# EAGLE design dnc (EAGLE 7.1.0)
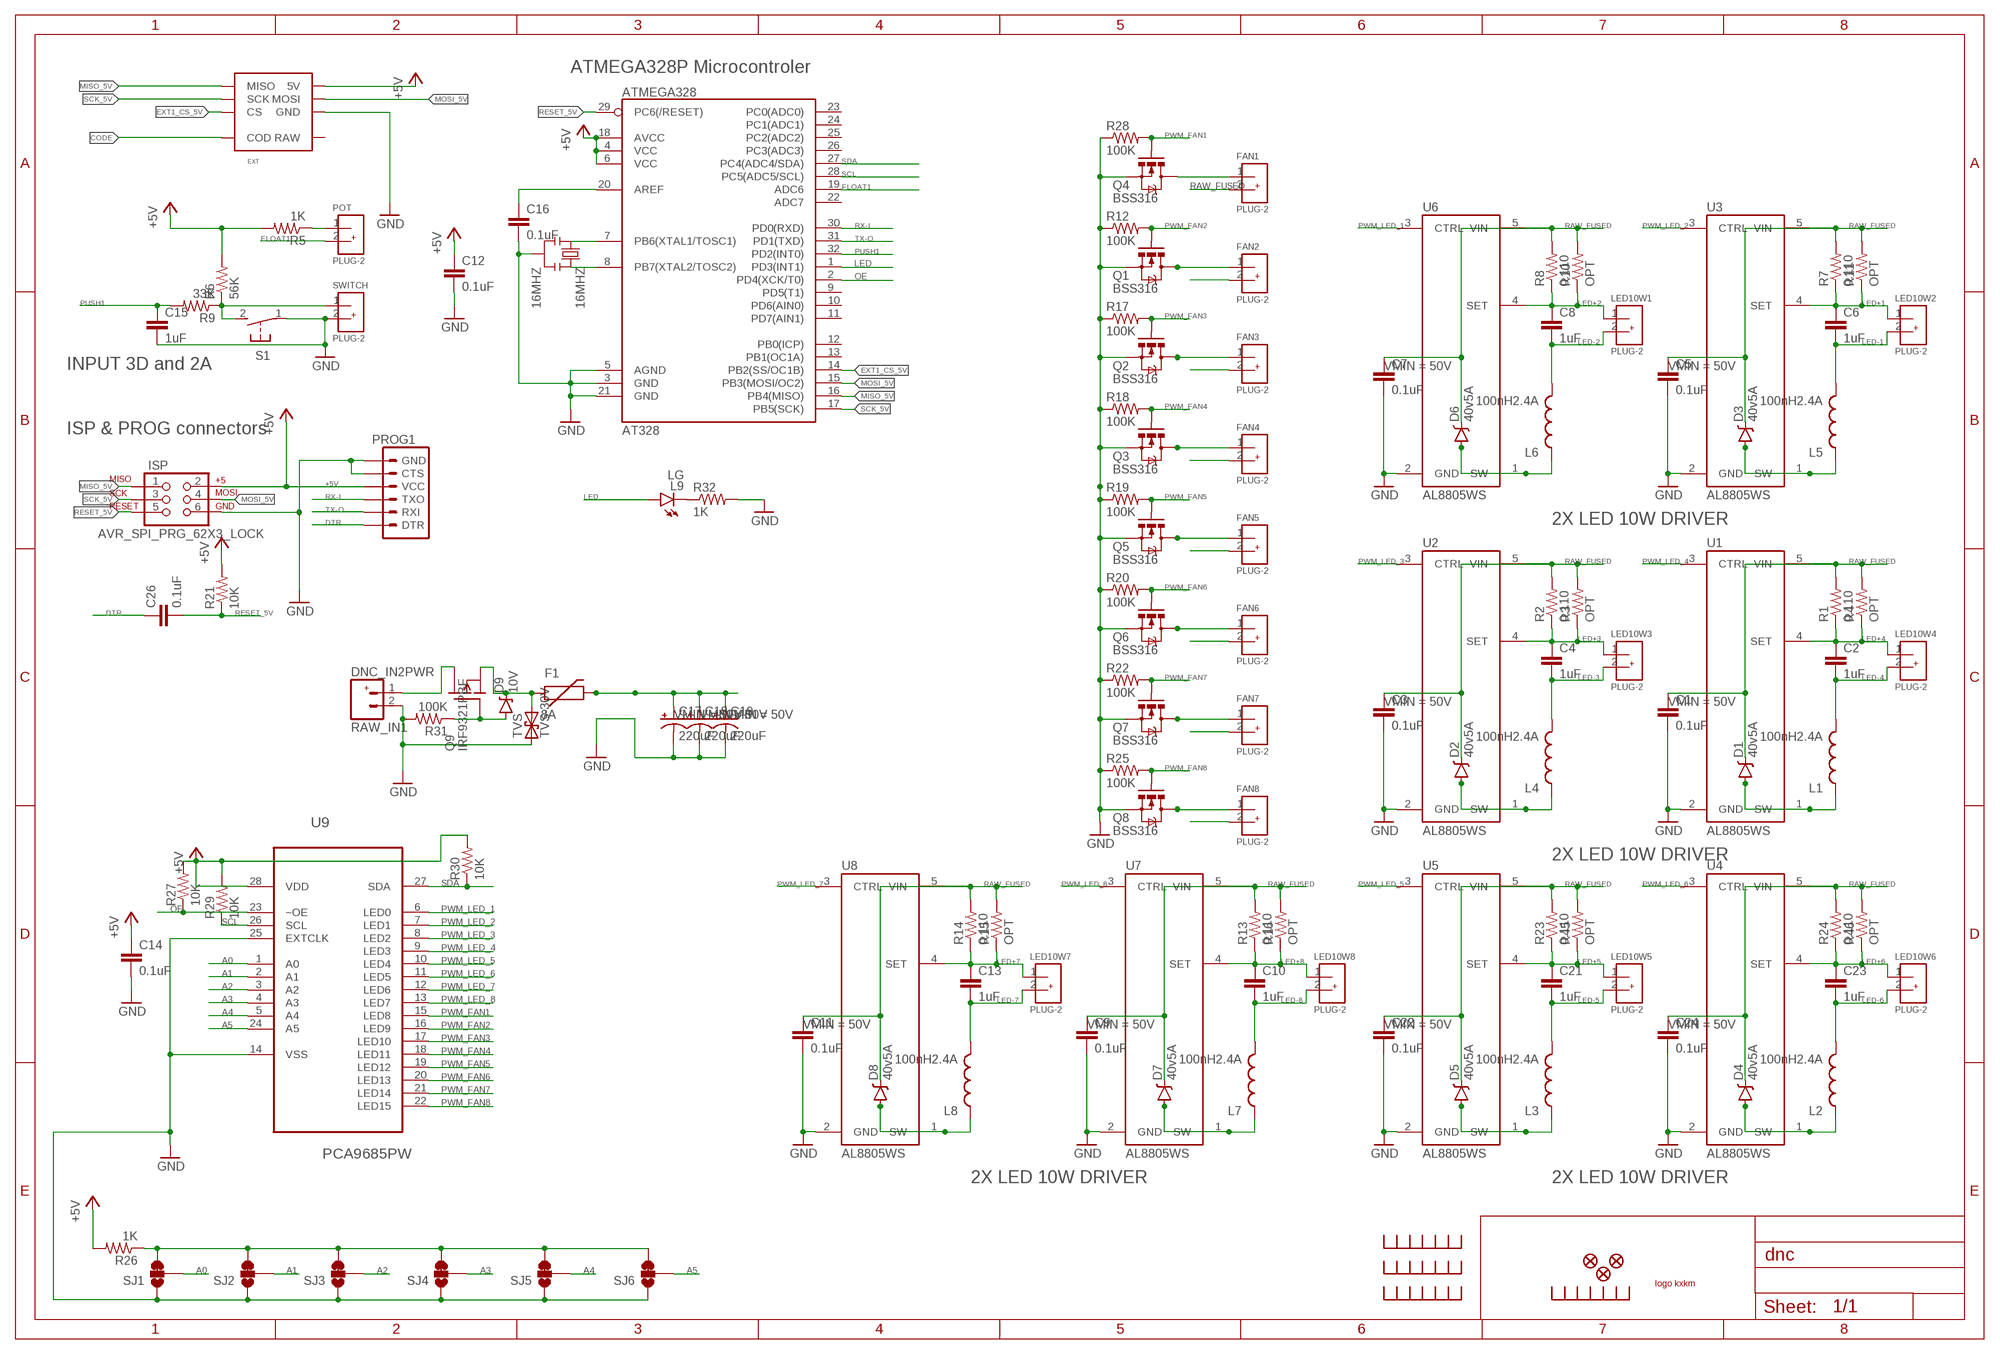
[diagram p0: schematic, sheet 1]

## Parts
16MHZ  16MHZ  RESONATOR16MHZ  [RESONATOR-SMD]
AT328  ATMEGA328  ATMEGA168  [TQFP32-08]
C1  0.1uF  C-EUC0603  [C0603]
C2  1uF  C-EUC0603  [C0603]
C3  0.1uF  C-EUC0603  [C0603]
C4  1uF  C-EUC0603  [C0603]
C5  0.1uF  C-EUC0603  [C0603]
C6  1uF  C-EUC0603  [C0603]
C7  0.1uF  C-EUC0603  [C0603]
C8  1uF  C-EUC0603  [C0603]
C9  0.1uF  C-EUC0603  [C0603]
C10  1uF  C-EUC0603  [C0603]
C11  0.1uF  C-EUC0603  [C0603]
C12  0.1uF  C-EUC0603  [C0603]
C13  1uF  C-EUC0603  [C0603]
C14  0.1uF  C-EUC0603  [C0603]
C15  1uF  C-EUC0603  [C0603]
C16  0.1uF  C-EUC0603  [C0603]
C17  220uF  CAP_POLE  [PANASONIC_E]
C18  220uF  CAP_POLE  [PANASONIC_E]
C19  220uF  CAP_POLE  [PANASONIC_E]
C21  1uF  C-EUC0603  [C0603]
C22  0.1uF  C-EUC0603  [C0603]
C23  1uF  C-EUC0603  [C0603]
C24  0.1uF  C-EUC0603  [C0603]
C26  0.1uF  C-EUC0603  [C0603]
D1  40v5A  DIODE_SCHOTKYSMPA  [DO-221]
D2  40v5A  DIODE_SCHOTKYSMPA  [DO-221]
D3  40v5A  DIODE_SCHOTKYSMPA  [DO-221]
D4  40v5A  DIODE_SCHOTKYSMPA  [DO-221]
D5  40v5A  DIODE_SCHOTKYSMPA  [DO-221]
D6  40v5A  DIODE_SCHOTKYSMPA  [DO-221]
D7  40v5A  DIODE_SCHOTKYSMPA  [DO-221]
D8  40v5A  DIODE_SCHOTKYSMPA  [DO-221]
D9  10V  DIODE-ZENERSOD-123  [SOD-123]
EXT1  EXT  EXT-DNC  [EXTPINDNC]
F1  8A  PTCPTH  [PTC]
FAN1  PLUG-2  M02PLUG  [PLUG_02]
FAN2  PLUG-2  M02PLUG  [PLUG_02]
FAN3  PLUG-2  M02PLUG  [PLUG_02]
FAN4  PLUG-2  M02PLUG  [PLUG_02]
FAN5  PLUG-2  M02PLUG  [PLUG_02]
FAN6  PLUG-2  M02PLUG  [PLUG_02]
FAN7  PLUG-2  M02PLUG  [PLUG_02]
FAN8  PLUG-2  M02PLUG  [PLUG_02]
ISP  AVR_SPI_PRG_62X3_LOCK  [2X3_LOCK]
JP13  FIDUCIAL1X2.5  [FIDUCIAL-1X2.5]
JP14  FIDUCIAL1X2.5  [FIDUCIAL-1X2.5]
JP19  FIDUCIAL1X2.5  [FIDUCIAL-1X2.5]
L1  100nH2.4A  INDUCTORPWR  [CDRH125]
L2  100nH2.4A  INDUCTORPWR  [CDRH125]
L3  100nH2.4A  INDUCTORPWR  [CDRH125]
L4  100nH2.4A  INDUCTORPWR  [CDRH125]
L5  100nH2.4A  INDUCTORPWR  [CDRH125]
L6  100nH2.4A  INDUCTORPWR  [CDRH125]
L7  100nH2.4A  INDUCTORPWR  [CDRH125]
L8  100nH2.4A  INDUCTORPWR  [CDRH125]
L9  LG  LED1206  [LED-1206]
LED10W1  PLUG-2  M02PLUG  [PLUG_02]
LED10W2  PLUG-2  M02PLUG  [PLUG_02]
LED10W3  PLUG-2  M02PLUG  [PLUG_02]
LED10W4  PLUG-2  M02PLUG  [PLUG_02]
LED10W5  PLUG-2  M02PLUG  [PLUG_02]
LED10W6  PLUG-2  M02PLUG  [PLUG_02]
LED10W7  PLUG-2  M02PLUG  [PLUG_02]
LED10W8  PLUG-2  M02PLUG  [PLUG_02]
POT  PLUG-2  M02PLUG  [PLUG_02]
PROG1  ARDUINO_SERIAL_PROGRAMLOCK  [1X06_LOCK]
Q1  BSS316  MOSFET-NCHANNELBSS316  [SOT23-3]
Q2  BSS316  MOSFET-NCHANNELBSS316  [SOT23-3]
Q3  BSS316  MOSFET-NCHANNELBSS316  [SOT23-3]
Q4  BSS316  MOSFET-NCHANNELBSS316  [SOT23-3]
Q5  BSS316  MOSFET-NCHANNELBSS316  [SOT23-3]
Q6  BSS316  MOSFET-NCHANNELBSS316  [SOT23-3]
Q7  BSS316  MOSFET-NCHANNELBSS316  [SOT23-3]
Q8  BSS316  MOSFET-NCHANNELBSS316  [SOT23-3]
Q9  IRF9321PBF  [SO-8]
R1  0.110  R-US_R0805  [R0805]
R2  0.110  R-US_R0805  [R0805]
R3  OPT  R-US_R0805  [R0805]
R4  OPT  R-US_R0805  [R0805]
R5  1K  RESISTOR0603-RES  [0603-RES]
R6  56K  RESISTOR0603-RES  [0603-RES]
R7  0.110  R-US_R0805  [R0805]
R8  0.110  R-US_R0805  [R0805]
R9  33K  RESISTOR0603-RES  [0603-RES]
R10  OPT  R-US_R0805  [R0805]
R11  OPT  R-US_R0805  [R0805]
R12  100K  RESISTOR0603-RES  [0603-RES]
R13  0.110  R-US_R0805  [R0805]
R14  0.110  R-US_R0805  [R0805]
R15  OPT  R-US_R0805  [R0805]
R16  OPT  R-US_R0805  [R0805]
R17  100K  RESISTOR0603-RES  [0603-RES]
R18  100K  RESISTOR0603-RES  [0603-RES]
R19  100K  RESISTOR0603-RES  [0603-RES]
R20  100K  RESISTOR0603-RES  [0603-RES]
R21  10K  RESISTOR0603-RES  [0603-RES]
R22  100K  RESISTOR0603-RES  [0603-RES]
R23  0.110  R-US_R0805  [R0805]
R24  0.110  R-US_R0805  [R0805]
R25  100K  RESISTOR0603-RES  [0603-RES]
R26  1K  RESISTOR0603-RES  [0603-RES]
R27  10K  RESISTOR0603-RES  [0603-RES]
R28  100K  RESISTOR0603-RES  [0603-RES]
R29  10K  RESISTOR0603-RES  [0603-RES]
R30  10K  RESISTOR0603-RES  [0603-RES]
R31  100K  RESISTOR0603-RES  [0603-RES]
R32  1K  RESISTOR0603-RES  [0603-RES]
R45  OPT  R-US_R0805  [R0805]
R46  OPT  R-US_R0805  [R0805]
RAW_IN1  DNC_IN2PWR  [DNC_IN2_PWR]
S1  31-XX  [B3F-31XX]
SJ1  JUMPER-PAD-3-2OF3_NC_BY_TRACE_LARGE  [PAD-JUMPER-3-2OF3_NC_BY_TRACE_YES_SILK_LARGE]
SJ2  JUMPER-PAD-3-2OF3_NC_BY_TRACE_LARGE  [PAD-JUMPER-3-2OF3_NC_BY_TRACE_YES_SILK_LARGE]
SJ3  JUMPER-PAD-3-2OF3_NC_BY_TRACE_LARGE  [PAD-JUMPER-3-2OF3_NC_BY_TRACE_YES_SILK_LARGE]
SJ4  JUMPER-PAD-3-2OF3_NC_BY_TRACE_LARGE  [PAD-JUMPER-3-2OF3_NC_BY_TRACE_YES_SILK_LARGE]
SJ5  JUMPER-PAD-3-2OF3_NC_BY_TRACE_LARGE  [PAD-JUMPER-3-2OF3_NC_BY_TRACE_YES_SILK_LARGE]
SJ6  JUMPER-PAD-3-2OF3_NC_BY_TRACE_LARGE  [PAD-JUMPER-3-2OF3_NC_BY_TRACE_YES_SILK_LARGE]
SWITCH  PLUG-2  M02PLUG  [PLUG_02]
TVS  TVS-30V  TVS  [SMA-DIODE]
U1  AL8805WS  AL8805  [SOT23-5]
U2  AL8805WS  AL8805  [SOT23-5]
U3  AL8805WS  AL8805  [SOT23-5]
U4  AL8805WS  AL8805  [SOT23-5]
U5  AL8805WS  AL8805  [SOT23-5]
U6  AL8805WS  AL8805  [SOT23-5]
U7  AL8805WS  AL8805  [SOT23-5]
U8  AL8805WS  AL8805  [SOT23-5]
U9  PCA9685PW  [SOP65P640X110-28N]
U$1  RADIATEUR  [RADIATEUR_577102B00000G]
U$2  LOGOSIZE2  [KXKMLOGO2]
U$3  RADIATEUR  [RADIATEUR_577102B00000G]
U$4  RADIATEUR  [RADIATEUR_577102B00000G]
U$5  RADIATEUR  [RADIATEUR_577102B00000G]

## Nets
+5V [5V]: AT328.4(VCC) AT328.6(VCC) AT328.18(AVCC) C12.1 C14.1 EXT1.5V ISP.2 PROG1.4(VCC) R5.2 R6.2 R21.2 R26.2 R27.2 R29.2 R30.2 U9.28(VDD)
A0: SJ1.2 U9.1(A0)
A1: SJ2.2 U9.2(A1)
A2: SJ3.2 U9.3(A2)
A3: SJ4.2 U9.4(A3)
A4: SJ5.2 U9.5(A4)
A5: SJ6.2 U9.24(A5)
AREF: AT328.20(AREF) C16.1
CODE: EXT1.RETOURANALOG(COD)
DTR: C26.1 PROG1.1(DTR)
EXT1_CS_5V: AT328.14(PB2(SS/OC1B)) EXT1./CS(CS)
FLOAT1: AT328.19(ADC6) POT.2
GND [GND]: 16MHZ.2 AT328.3(GND) AT328.5(AGND) AT328.21(GND) C1.2 C3.2 C5.2 C7.2 C9.2 C11.2 C12.2 C14.2 C15.2 C16.2 C17.- C18.- C19.- C22.2 C24.2 EXT1.1_GND(GND) EXT1.GND2(GND) ISP.6 PROG1.5(CTS) PROG1.6(GND) Q1.2(S) Q2.2(S) Q3.2(S) Q4.2(S) Q5.2(S) Q6.2(S) Q7.2(S) Q8.2(S) R12.1 R17.1 R18.1 R19.1 R20.1 R22.1 R25.1 R28.1 R31.2 R32.2 RAW_IN1.2(-) S1.1(P) SJ1.1 SJ2.1 SJ3.1 SJ4.1 SJ5.1 SJ6.1 SWITCH.2 TVS.A U1.2(GND) U2.2(GND) U3.2(GND) U4.2(GND) U5.2(GND) U6.2(GND) U7.2(GND) U8.2(GND) U9.14(VSS) U9.25(EXTCLK)
LED: AT328.1(PD3(INT1)) L9.A
LED+1 [5V]: C6.1 LED10W2.1 R7.1 R11.1 U3.4(SET)
LED+2 [5V]: C8.1 LED10W1.1 R8.1 R10.1 U6.4(SET)
LED+3 [5V]: C4.1 LED10W3.1 R2.1 R3.1 U2.4(SET)
LED+4 [5V]: C2.1 LED10W4.1 R1.1 R4.1 U1.4(SET)
LED+5 [5V]: C21.1 LED10W5.1 R23.1 R45.1 U5.4(SET)
LED+6 [5V]: C23.1 LED10W6.1 R24.1 R46.1 U4.4(SET)
LED+7 [5V]: C13.1 LED10W7.1 R14.1 R15.1 U8.4(SET)
LED+8 [5V]: C10.1 LED10W8.1 R13.1 R16.1 U7.4(SET)
LED-1 [5V]: C6.2 L5.2 LED10W2.2
LED-2 [5V]: C8.2 L6.2 LED10W1.2
LED-3 [5V]: C4.2 L4.2 LED10W3.2
LED-4 [5V]: C2.2 L1.2 LED10W4.2
LED-5 [5V]: C21.2 L3.2 LED10W5.2
LED-6 [5V]: C23.2 L2.2 LED10W6.2
LED-7 [5V]: C13.2 L8.2 LED10W7.2
LED-8 [5V]: C10.2 L7.2 LED10W8.2
MISO_5V: AT328.16(PB4(MISO)) EXT1.MISO ISP.1
MOSI_5V: AT328.15(PB3(MOSI/OC2)) EXT1.MOSI ISP.4
N$3: D1.A L1.1 U1.1(SW)
N$4: FAN1.1 Q4.3(D)
N$5: D2.A L4.1 U2.1(SW)
N$6: D4.A L2.1 U4.1(SW)
N$7: D5.A L3.1 U5.1(SW)
N$8: D3.A L5.1 U3.1(SW)
N$9: D6.A L6.1 U6.1(SW)
N$10: D7.A L7.1 U7.1(SW)
N$11: D8.A L8.1 U8.1(SW)
N$12: FAN2.1 Q1.3(D)
N$13: FAN3.1 Q2.3(D)
N$14: FAN4.1 Q3.3(D)
N$15: FAN5.1 Q5.3(D)
N$16: FAN6.1 Q6.3(D)
N$17: FAN7.1 Q7.3(D)
N$18: FAN8.1 Q8.3(D)
N$22: R6.1 R9.1 S1.2(S) SWITCH.1
N$25: POT.1 R5.1
N$30: R26.1 SJ1.3 SJ2.3 SJ3.3 SJ4.3 SJ5.3 SJ6.3
N$35: L9.C R32.1
N$43: 16MHZ.1 AT328.7(PB6(XTAL1/TOSC1))
N$44: 16MHZ.3 AT328.8(PB7(XTAL2/TOSC2))
OE: AT328.2(PD4(XCK/T0)) R27.1 U9.23(~OE)
PROTECT_GATE: D9.A Q9.4(G) R31.1
PUSH1: AT328.32(PD2(INT0)) C15.1 R9.2
PWM_FAN1: Q4.1(G) R28.2 U9.15(LED8)
PWM_FAN2: Q1.1(G) R12.2 U9.16(LED9)
PWM_FAN3: Q2.1(G) R17.2 U9.17(LED10)
PWM_FAN4: Q3.1(G) R18.2 U9.18(LED11)
PWM_FAN5: Q5.1(G) R19.2 U9.19(LED12)
PWM_FAN6: Q6.1(G) R20.2 U9.20(LED13)
PWM_FAN7: Q7.1(G) R22.2 U9.21(LED14)
PWM_FAN8: Q8.1(G) R25.2 U9.22(LED15)
PWM_LED_1: U6.3(CTRL) U9.6(LED0)
PWM_LED_2: U3.3(CTRL) U9.7(LED1)
PWM_LED_3: U2.3(CTRL) U9.8(LED2)
PWM_LED_4: U1.3(CTRL) U9.9(LED3)
PWM_LED_5: U5.3(CTRL) U9.10(LED4)
PWM_LED_6: U4.3(CTRL) U9.11(LED5)
PWM_LED_7: U8.3(CTRL) U9.12(LED6)
PWM_LED_8: U7.3(CTRL) U9.13(LED7)
RAW_FUSED [5V]: C1.1 C3.1 C5.1 C7.1 C9.1 C11.1 C17.+ C18.+ C19.+ C22.1 C24.1 D1.C D2.C D3.C D4.C D5.C D6.C D7.C D8.C F1.P$2 FAN1.2 FAN2.2 FAN3.2 FAN4.2 FAN5.2 FAN6.2 FAN7.2 FAN8.2 R1.2 R2.2 R3.2 R4.2 R7.2 R8.2 R10.2 R11.2 R13.2 R14.2 R15.2 R16.2 R23.2 R24.2 R45.2 R46.2 U1.5(VIN) U2.5(VIN) U3.5(VIN) U4.5(VIN) U5.5(VIN) U6.5(VIN) U7.5(VIN) U8.5(VIN)
RAW_POL_PROTECTED1 [5V]: D9.C F1.P$1MOV Q9.1(S) Q9.2(S) Q9.3(S) TVS.C
RAW_UNPROTECTED1 [5V]: Q9.5(D) Q9.6(D) Q9.7(D) Q9.8(D) RAW_IN1.1(+)
RESET_5V: AT328.29(PC6(/RESET)) C26.2 ISP.5 R21.1
RX-I: AT328.30(PD0(RXD)) PROG1.3(TXO)
SCK_5V: AT328.17(PB5(SCK)) EXT1.SCK ISP.3
SCL: AT328.28(PC5(ADC5/SCL)) R29.1 U9.26(SCL)
SDA: AT328.27(PC4(ADC4/SDA)) R30.1 U9.27(SDA)
TX-O: AT328.31(PD1(TXD)) PROG1.2(RXI)
Unconnected: AT328.9(PD5(T1)) AT328.10(PD6(AIN0)) AT328.11(PD7(AIN1)) AT328.12(PB0(ICP)) AT328.13(PB1(OC1A)) AT328.22(ADC7) AT328.23(PC0(ADC0)) AT328.24(PC1(ADC1)) AT328.25(PC2(ADC2)) AT328.26(PC3(ADC3)) EXT1.RAW EXT1.RAW2(RAW)

## Notes on the sheet
- ATMEGA328P Microcontroler
- INPUT 3D and 2A
- ISP & PROG connectors
- 2X LED 10W DRIVER
- 2X LED 10W DRIVER
- 2X LED 10W DRIVER | 2X LED 10W DRIVER

## Library data of the parts
16MHZ = SparkFun-FreqCtrl:RESONATOR: Resonator Small SMD resonator. Used, eg, on the Arduino Pro/ Pro Mini boards. 8MHz- XTAL-08895 16MHz- XTAL-08900; OC_FARNELL: 2101363; PROD_ID: XTAL-08900
AT328 = SparkFun:ATMEGA168; OC_FARNELL: 2443176
C1 C3 C5 C7 C9 C11 C22 C24 = rcl:C-EU: CAPACITOR, European symbol; VMIN: 50V
C2 C4 C6 C8 C10 C12-C16 C21 C23 C26 = rcl:C-EU: CAPACITOR, European symbol
C17-C19 = SparkFun:CAP_POL: Capacitor Polarized These are standard SMD and PTH capacitors. Normally 10uF, 47uF, and 100uF in electrolytic and tantalum varieties. Always verify the external diameter of the through hole cap, it varies with capacity, voltage, and manufacturer. The EIA devices should be standard.; OC_FARNELL: 1800687; VMIN: 50V
D1-D8 = pierre_vv:DIODE_SCHOTKY; OC_FARNELL: 1861427
D9 = SparkFun-DiscreteSemi:DIODE-ZENER: Zener Diode Production Part - 8199 3.4V Zener Voltage; OC_FARNELL: 1431256
EXT1 = pierre_vv:EXT-DNC; MOUNT: NO
F1 = SparkFun:PTC: Resettable Fuse PTC Resettable Fuse. Spark Fun Electronics SKU : COM-08357; MOUNT: NO; OC_FARNELL: 1861144
FAN1-FAN8 LED10W1-LED10W8 POT SWITCH = pierre_vv:M02; MOUNT: NO
ISP = SparkFun:AVR_SPI_PRG_6: AVR ISP 6 Pin This is the reduced ISP connector for AVR programming. Common on Arduino. This footprint will take up less PCB space and can be used with a 10-pin to 6-pin adapter such as SKU: BOB-08508; MOUNT: NO
JP13 JP14 JP19 = SparkFun:FIDUCIAL: Fiducial Alignment Points Various fiducial points for machine vision alignment.; MOUNT: NO
L1-L8 = SparkFun:INDUCTOR: Inductors Basic Inductor/Choke - 0603 and 1206. Footprints are not proven and vary greatly between part numbers.; OC_FARNELL: 1864459RL
L9 = SparkFun-LED:LED: LEDs Standard schematic elements and footprints for 5mm, 3mm, 1206, and 0603 sized LEDs. 5mm - Spark Fun Electronics SKU : COM-00529 (and others)
PROG1 = SparkFun:ARDUINO_SERIAL_PROGRAM; MOUNT: NO
Q1-Q8 = SparkFun-DiscreteSemi:MOSFET-NCHANNEL: Common NMOSFET Parts MFG P/N Store ID Prod ID FDD8780 TRANS-09984 SI7820DN TRANS-11055 FDS6630A IC-08089 2N7002PW TRANS-11151 FQP30N06L COM-10213 TRANS-10060 BSS123LT1G TRANS-08345 BSS138 TRANS-00830 BS170 2N7000; OC_FARNELL: 2432720
Q9 = pierre_vv:IRF9321PBF; OC_FARNELL: 1831075
R1 R2 R7 R8 R13 R14 R23 R24 = rcl:R-US_: RESISTOR, American symbol
R3 R4 R10 R11 R15 R16 R45 R46 = rcl:R-US_: RESISTOR, American symbol; MOUNT: NO
R5 R6 R9 R12 R17-R22 R25-R32 = SparkFun-Passives:RESISTOR: Resistor Basic schematic elements and footprints for 0603, 1206, and PTH resistors.
RAW_IN1 = pierre_vv:DNC_IN2; MOUNT: NO
S1 = switch-omron:31-XX: OMRON SWITCH; MPN: B3F-3100; OC_FARNELL: 2079502; OC_NEWARK: 36M3582
SJ1-SJ6 = SparkFun-Passives:JUMPER-PAD-3-2OF3_NC_BY_TRACE
TVS = SparkFun:TVS; OC_FARNELL: 9802819RL
U1-U8 = SparkFun-PowerIC:AL8805: Constant current LED driver PWM-able 1MHz switch freq 6V-36V Up to 1A LED current; OC_FARNELL: 2138313; PROD_ID: IC-11626
U9 = pierre_vv:PCA9685PW: 16-channel, 12-bit PWM Fm+ I2C-bus LED controller; MPN: PCA9685PW; OC_FARNELL: 1854074; OC_NEWARK: 19T6398; PACKAGE: TSSOP-28; SUPPLIER: NXP
U$1 U$3-U$5 = pierre_vv:RADIATEUR; MOUNT: NO; OC_FARNELL: 1703172
U$2 = pierre_vv:LOGO; MOUNT: NO

## Net classes
0 default: width 0.203 mm
1 GND: width 0.254 mm
2 3.3V: width 0.203 mm
3 5V: width 0.305 mm
4 230AC: width 0.61 mm, clearance 0.305 mm

## Board
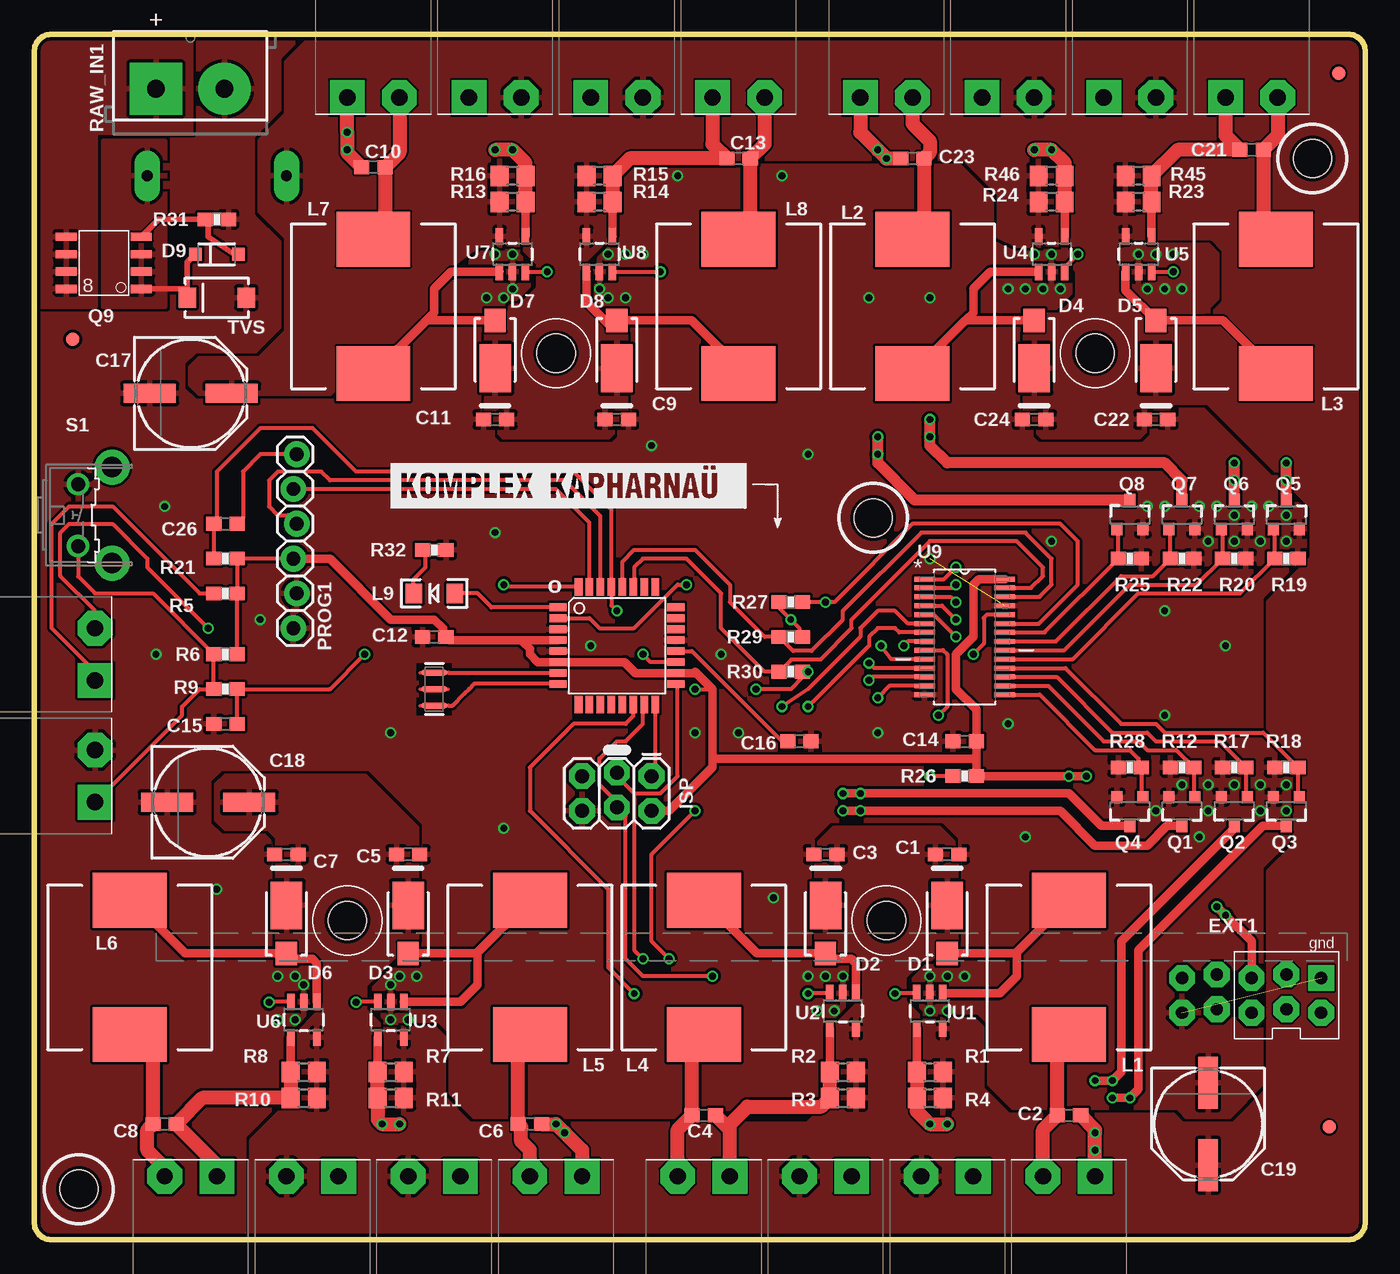
[diagram p1: board, top side]
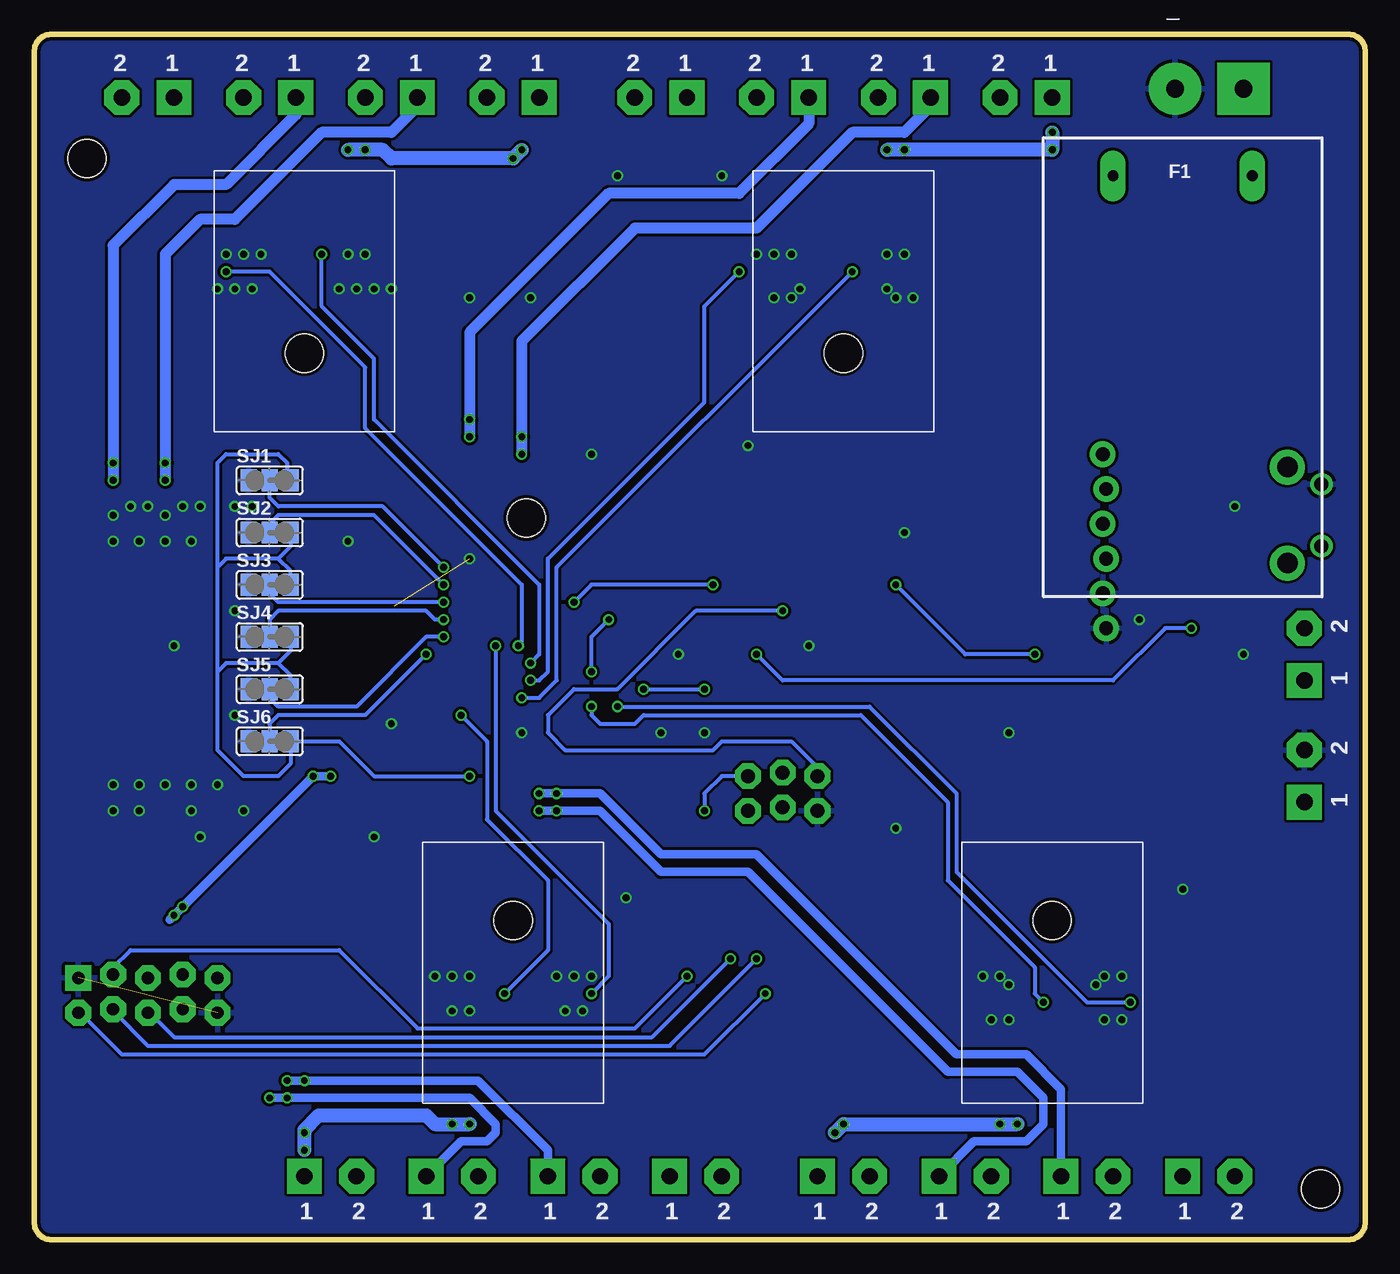
[diagram p2: board, bottom side, seen from below]

Size 97.2 x 88 mm. Coordinates in mm from the lower left corner, seen from the top.
Outline: 0,86.73 0,1.27 arc90 1.27,0 95.93,0 arc90 97.2,1.27 97.2,86.73 arc90 95.93,88 1.27,88 arc90 0,86.73
Copper layers (1*16): Top 0.035mm / dielectric 1.5mm / Bottom 0.035mm
Design rules "SeeedStudio_2layer_DRU_no_angle_20140221 *": minimum track width 6mil, minimum drill 12mil, track to track 6mil, track to pad 6mil, pad to pad 6mil, via to via 6mil, smd to smd 0mil, copper to edge 10mil, drill to drill 10mil, minimum pad ring 12mil, minimum via ring 6mil, stop-mask expansion 2mil, vias tented up to drill 100mil, thermal gap 10mil
Holes 2.8 mm at 93.34,78.93 3.26,3.7 61.26,52.69

### Footprints (pad centres in the part's own frame; a part is rotated, then mirrored left to right if it is on the bottom)
RESONATOR-SMD = smd 0.45 x 1.905: 1 -1.2,0; 2 0,0; 3 1.2,0
TQFP32-08 = smd 1.27 x 0.559: 1 -4.293,2.8; 2 -4.293,2; 3 -4.293,1.2; 4 -4.293,0.4; 5 -4.293,-0.4; 6 -4.293,-1.2; 7 -4.293,-2; 8 -4.293,-2.8; 17 4.293,-2.8; 18 4.293,-2; 19 4.293,-1.2; 20 4.293,-0.4; 21 4.293,0.4; 22 4.293,1.2; 23 4.293,2; 24 4.293,2.8 | smd 0.559 x 1.27: 9 -2.8,-4.293; 10 -2,-4.293; 11 -1.2,-4.293; 12 -0.4,-4.293; 13 0.4,-4.293; 14 1.2,-4.293; 15 2,-4.293; 16 2.8,-4.293; 25 2.8,4.293; 26 2,4.293; 27 1.2,4.293; 28 0.4,4.293; 29 -0.4,4.293; 30 -1.2,4.293; 31 -2,4.293; 32 -2.8,4.293
C0603 = smd 1.1 x 1: 1 -0.85,0; 2 0.85,0
PANASONIC_E = smd 3.8 x 1.4: + 3,0; - -3,0
DO-221 = smd 1.7 x 1.55: A -2.15,0 | smd 3.5 x 2.3: C 1.35,0
SOD-123 = smd 0.9 x 0.95: A 1.575,0; C -1.575,0
EXTPINDNC = drill 0.9 pad 1.88 square: 1_GND -1.143,5.08 | drill 0.9 pad 1.88 octagon: 5V -1.143,0; /CS 1.397,5.08; GND2 1.397,-5.08; MISO 1.397,0; MOSI -1.397,2.54; RAW -1.397,-2.54; RAW2 1.143,-2.54; RETOURANALOG -1.143,-5.08; SCK 1.143,2.54
PTC = drill 0.8 pad 1.88 long: P$1MOV -5.08,0; P$2 5.08,0
PLUG_02 = drill 1.2 pad 2.54 square: 1 -1.905,0 | drill 1.2 pad 2.54 octagon: 2 1.905,0
2X3_LOCK = drill 1.016 pad 1.88 octagon: 1 0,0; 2 0,2.54; 3 2.54,-0.254; 4 2.54,2.286; 5 5.08,0; 6 5.08,2.54
FIDUCIAL-1X2.5 = smd 1 x 1: 1 0,0
CDRH125 = smd 5.4 x 4: 1 0,4.9; 2 0,-4.9
LED-1206 = smd 1.2 x 1.4: A -1.5,0; C 1.5,0
1X06_LOCK = drill 1.016 pad 1.88: 1 0,0; 2 2.54,-0.254; 3 5.08,0; 4 7.62,-0.254; 5 10.16,0; 6 12.7,-0.254
SOT23-3 = smd 0.8 x 0.9: 1 -0.95,-1; 2 0.95,-1; 3 0,1.1
SO-8 = smd 1.524 x 0.61: 1 -2.743,1.905; 2 -2.743,0.635; 3 -2.743,-0.635; 4 -2.743,-1.905; 5 2.743,-1.905; 6 2.743,-0.635; 7 2.743,0.635; 8 2.743,1.905
R0805 = smd 1.3 x 1.5: 1 -0.95,0; 2 0.95,0
0603-RES = smd 1.1 x 1: 1 -0.85,0; 2 0.85,0
DNC_IN2_PWR = drill 1.3 pad 3.81 square: 1 0,0 | drill 1.3 pad 3.81: 2 5,0
B3F-31XX = drill 1.016: 1 -2.261,-1.245; 2 2.261,-1.245 | drill 1.499 pad 2.54: 3 -3.505,1.245; 4 3.505,1.245
PAD-JUMPER-3-2OF3_NC_BY_TRACE_YES_SILK_LARGE = smd 1.168 x 1.6: 1 -1.524,0; 2 0,0; 3 1.524,0
SMA-DIODE = smd 1.27 x 1.47: A -2.15,0; C 2.15,0
SOT23-5 = smd 0.55 x 1.2: 1 -0.95,-1.3; 2 0,-1.3; 3 0.95,-1.3; 4 0.95,1.3; 5 -0.95,1.3
SOP65P640X110-28N = smd 1.473 x 0.356: 1 -2.921,4.216; 2 -2.921,3.581; 3 -2.921,2.921; 4 -2.921,2.286; 5 -2.921,1.626; 6 -2.921,0.965; 7 -2.921,0.33; 8 -2.921,-0.33; 9 -2.921,-0.965; 10 -2.921,-1.626; 11 -2.921,-2.286; 12 -2.921,-2.921; 13 -2.921,-3.581; 14 -2.921,-4.216; 15 2.921,-4.216; 16 2.921,-3.581; 17 2.921,-2.921; 18 2.921,-2.286; 19 2.921,-1.626; 20 2.921,-0.965; 21 2.921,-0.33; 22 2.921,0.33; 23 2.921,0.965; 24 2.921,1.626; 25 2.921,2.286; 26 2.921,2.921; 27 2.921,3.581; 28 2.921,4.216
RADIATEUR_577102B00000G = hole 2.8: 0,0

### Placement (x,y rotation side)
16MHZ  29.21,40.2 270 top
AT328  42.55,43.37 0 top
C1  66.67,28.13 0 top
C2  75.56,9.08 180 top
C3  57.78,28.13 180 top
C4  48.9,9.08 180 top
C5  27.3,28.13 0 top
C6  36.2,8.45 180 top
C7  18.41,28.13 180 top
C8  9.53,8.45 180 top
C9  42.55,59.88 0 top
C10  24.77,78.3 0 top
C11  33.66,59.88 180 top
C12  29.21,44.01 180 top
C13  51.44,78.93 0 top
C14  67.94,36.38 180 top
C15  13.97,37.66 180 top
C16  55.88,36.38 0 top
C17  11.43,61.78 0 top
C18  12.7,31.94 0 top
C19  85.72,8.45 270 top
C21  88.9,79.56 0 top
C22  81.92,59.88 0 top
C23  64.14,78.93 0 top
C24  73.03,59.88 180 top
C26  13.97,52.26 180 top
D1  66.67,23.05 90 top
D2  57.78,23.05 90 top
D3  27.3,23.05 90 top
D4  73.03,64.96 270 top
D5  81.92,64.96 270 top
D6  18.41,23.05 90 top
D7  33.66,64.96 270 top
D8  42.55,64.96 270 top
D9  13.34,71.94 0 top
EXT1  88.9,17.97 270 top
F1  13.34,77.66 180 bottom
FAN1  20.32,4.63 180 top
FAN2  29.21,4.63 180 top
FAN3  57.78,4.63 180 top
FAN4  66.67,4.63 180 top
FAN5  80.01,83.38 0 top
FAN6  71.12,83.38 0 top
FAN7  42.55,83.38 0 top
FAN8  33.66,83.38 0 top
ISP  45.09,33.84 180 top
JP13  2.79,65.72 0 top
JP14  95.25,85.15 180 top
JP19  94.56,8.23 0 top
L1  75.56,19.88 0 top
L2  64.14,68.14 180 top
L3  90.68,68.14 180 top
L4  48.9,19.88 0 top
L5  36.2,19.88 0 top
L6  6.99,19.88 0 top
L7  24.77,68.14 180 top
L8  51.44,68.14 180 top
L9  29.21,47.18 180 top
LED10W1  11.43,4.63 180 top
LED10W2  38.1,4.63 180 top
LED10W3  48.9,4.63 180 top
LED10W4  75.56,4.63 180 top
LED10W5  88.9,83.38 0 top
LED10W6  62.23,83.38 0 top
LED10W7  51.44,83.38 0 top
LED10W8  24.77,83.38 0 top
POT  4.45,42.73 90 top
PROG1  19.18,57.34 270 top
Q1  83.82,31.3 180 top
Q2  87.63,31.3 180 top
Q3  91.44,31.3 180 top
Q4  80.01,31.3 180 top
Q5  91.44,52.9 0 top
Q6  87.63,52.9 0 top
Q7  83.82,52.9 0 top
Q8  80.01,52.9 0 top
Q9  5.08,71.31 180 top
R1  65.41,12.26 0 top
R2  59.05,12.26 0 top
R3  59.05,10.35 0 top
R4  65.41,10.35 0 top
R5  13.97,47.18 0 top
R6  13.97,42.73 0 top
R7  26.04,12.26 0 top
R8  19.68,12.26 0 top
R9  13.97,40.2 0 top
R10  19.68,10.35 0 top
R11  26.04,10.35 0 top
R12  83.82,34.48 0 top
R13  34.92,75.75 180 top
R14  41.27,75.75 180 top
R15  41.27,77.66 180 top
R16  34.92,77.66 180 top
R17  87.63,34.48 0 top
R18  91.44,34.48 0 top
R19  91.44,49.72 180 top
R20  87.63,49.72 180 top
R21  13.97,49.72 0 top
R22  83.82,49.72 180 top
R23  80.64,75.75 180 top
R24  74.3,75.75 180 top
R25  80.01,49.72 180 top
R26  67.94,33.84 0 top
R27  55.24,46.55 180 top
R28  80.01,34.48 0 top
R29  55.24,44.01 0 top
R30  55.24,41.47 0 top
R31  13.34,74.48 0 top
R32  29.21,50.35 0 top
R45  80.64,77.66 180 top
R46  74.3,77.66 180 top
RAW_IN1  8.89,84.01 0 top
S1  4.45,52.9 270 top
SJ1  80.01,55.44 0 bottom
SJ2  80.01,51.62 0 bottom
SJ3  80.01,47.81 0 bottom
SJ4  80.01,44.01 0 bottom
SJ5  80.01,40.2 0 bottom
SJ6  80.01,36.38 0 bottom
SWITCH  4.45,33.84 90 top
TVS  13.34,68.77 180 top
U1  65.41,16.7 180 top
U2  59.05,16.7 180 top
U3  26.04,16.06 180 top
U4  74.3,71.94 0 top
U5  80.64,71.94 0 top
U6  19.68,16.06 180 top
U7  34.92,71.94 0 top
U8  41.27,71.94 0 top
U9  67.94,44.01 0 top
U$1  77.47,64.71 270 bottom
U$2  26.04,49.72 0 top
U$3  62.23,23.3 90 bottom
U$4  38.1,64.71 270 bottom
U$5  22.86,23.3 90 bottom

### Tracks (layer width: path | path; a pad name or v marks a point on that pad's centre or on a via)
+5V  (via drill 0.5)
  Top 0.305: PROG1.4 R21.2 R5.2 R6.2 | R27.2 54.4,46.12 v55.24,45.27 55.88,44.64 55.88,44.22 R29.2 | v52.7,40.2 55.24,40.2 56.09,41.05 R30.2 v56.52,41.47 | v48.26,40.2 49.53,40.2
  Top 0.61: AT328.4 35.56,43.77 | 35.56,43.77 30.3,43.77 C12.1 29.84,44.22 29.84,44.64 29.21,45.27 26.04,45.27 21.59,49.72 PROG1.4 | 35.56,43.77 36.2,43.13 36.2,42.73 36.76,42.17 AT328.6 43.11,42.17 43.91,41.37 AT328.18 48.16,41.37 48.26,41.47 49.53,40.2 49.53,35.11 | 49.53,35.11 49.53,34.48 46.35,31.3 ISP.2 | U9.28 68.99,48.22 68.58,47.81 68.58,44.01 67.31,42.73 67.31,40.2 68.8,38.71 C14.1 68.8,35.11 | 68.8,35.11 R26.2 v75.56,33.84 v76.83,33.84 | 49.53,35.11 68.8,35.11 | EXT1.5V 88.9,21.78 v87,23.68 v86.36,24.32
  Bottom 0.305: v52.7,40.2 v48.26,40.2 | v56.52,41.47 56.52,44.01 v55.24,45.27
  Bottom 0.61: v75.56,33.84 v76.83,33.84 v86.36,24.32 v87,23.68 87.31,23.37
A0  (via drill 0.5)
  Top 0.305: U9.1 66.45,48.22 v67.31,49.09
  Bottom 0.305: v67.31,49.09 71.75,53.53 79.38,53.53 80.01,54.16 SJ1.2
A1  (via drill 0.5)
  Top 0.305: U9.2 67.08,47.59 v67.31,47.81
  Bottom 0.305: v67.31,47.81 72.39,52.9 79.38,52.9 80.01,52.26 SJ2.2
A2  (via drill 0.5)
  Top 0.305: U9.3 66.93,46.93 v67.31,46.55
  Bottom 0.305: v67.31,46.55 79.38,46.55 80.01,47.18 SJ3.2
A3  (via drill 0.5)
  Top 0.305: U9.4 66.29,46.29 v67.31,45.27
  Bottom 0.305: v67.31,45.27 67.94,45.27 68.58,45.91 79.38,45.91 80.01,45.27 SJ4.2
A4  (via drill 0.5)
  Top 0.305: U9.5 65.68,45.63 v67.31,44.01
  Bottom 0.305: v67.31,44.01 68.58,44.01 73.66,38.92 79.38,38.92 80.01,39.56 SJ5.2
A5  (via drill 0.5)
  Top 0.305: U9.24 69.57,45.63 69.34,45.4 69.34,43.5 v68.58,42.73
  Bottom 0.305: v68.58,42.73 73.03,38.29 79.38,38.29 80.01,37.66 SJ6.2
AREF
  Top 0.305: AT328.20 48.02,42.97 54.61,36.38 C16.1
DTR
  Top 0.305: PROG1.1 16.51,57.34 15.24,56.07 15.24,52.68 C26.1
EXT1_CS_5V  (via drill 0.5)
  Top 0.305: AT328.14 43.74,38.22 43.18,37.66 39.37,37.66 36.2,34.48 36.2,31.3 41.91,25.59 41.91,19.88 v43.81,17.97
  Bottom 0.305: EXT1./CS 93.85,16.57 90.81,13.53 48.26,13.53 v43.81,17.97
FLOAT1  (via drill 0.5)
  Top 0.305: POT.2 4.45,45.91 1.91,48.45 1.91,51.62 2.54,52.26 5.71,52.26 8.26,49.72 8.26,49.09 v12.7,44.64 | AT328.19 45.02,42.17 v44.45,42.73
  Bottom 0.305: v12.7,44.64 14.61,44.64 18.41,40.83 42.55,40.83 v44.45,42.73
GND  (via drill 0.5)  (2 unrouted)
  other vias: 65.41,68.77 71.12,69.41 73.66,69.41 72.39,69.41 60.96,68.77 73.03,71.94 82.55,69.41 74.93,69.41 83.82,69.41 81.28,69.41 74.3,71.94 87,43.37 80.64,71.94 81.92,71.94 83.19,71.94 41.91,71.94 43.18,71.94 41.27,69.41 41.91,68.77 43.18,68.77 44.45,71.94 34.92,71.94 33.66,71.94 34.92,69.41 34.29,68.77 33.02,68.77 19.05,16.06 17.78,16.06 19.68,18.61 19.05,19.24 17.78,19.24 26.04,16.06 27.3,16.06 26.04,18.61 26.67,19.24 27.94,19.24 58.42,16.7 57.15,16.7 59.05,19.24 57.78,19.24 56.52,19.24 65.41,19.24 66.67,19.24 67.94,19.24 65.41,16.7 66.67,16.7 81.28,53.53 82.55,53.53 85.09,53.53 86.36,53.53 88.9,53.53 87.63,52.9 90.17,53.53 91.44,52.9 91.44,50.99 87.63,50.99 85.72,50.99 89.53,50.99 74.3,50.99 91.44,31.3 91.44,33.21 89.53,31.3 85.09,29.4 85.72,31.3 81.92,31.3 83.82,33.21 87.63,33.21 85.72,33.21 89.53,33.21 46.99,77.66 54.61,77.66 71.12,37.66 61.59,37.02 82.55,38.29 82.55,45.91 72.39,29.4 53.98,24.95 34.29,30.04 26.04,37.02 33.66,51.62 45.09,57.98 56.52,57.34 13.34,25.59 8.89,42.73 9.53,53.53 16.51,45.27 40.64,43.37 50.16,42.73 51.44,37.02 48.26,37.02 65.41,49.72
  pour Bottom (isolate 0.203, rank 4): -2.54,90.36 99.69,90.36 99.69,-2.99 -2.54,-2.99
  pour Top (isolate 0.203, rank 4): -3.81,91.63 101.6,91.63 101.6,-4.26 -3.81,-4.26
  pour Top: 80.01,72.58 85.72,72.58 86.36,71.94 86.36,68.77 85.09,67.5 81.28,67.5 79.38,69.41 79.38,71.94
LED
  Top 0.305: AT328.1 33.4,46.17 32.38,47.18 L9.A
LED+1  (via drill 0.5)
  Top 0.61: R7.1 U3.4
  Top 1.016: C6.1 v38.1,8.45 v38.73,7.81 40.01,6.54 LED10W2.1 | R7.1 R11.1 25.09,8.76 v25.4,8.45 v26.67,8.45
  Bottom 1.016: v38.73,7.81 v38.1,8.45 v25.4,8.45
LED+2
  Top 0.61: R8.1 U6.4
  Top 1.016: LED10W1.1 13.34,5.49 C8.1 12.28,10.35 R10.1 R8.1
LED+3
  Top 0.61: R2.1 U2.4
  Top 1.016: LED10W3.1 50.8,8.03 | 50.8,8.03 C4.1 | 50.8,8.03 50.8,8.45 52.07,9.71 57.47,9.71 R3.1 R2.1
LED+4  (via drill 0.5)
  Top 0.61: R1.1 U1.4
  Top 1.016: R1.1 R4.1 64.45,9.39 v65.41,8.45 v66.67,8.45 | C2.1 77.47,8.03 v77.47,7.81 LED10W4.1
  Bottom 1.016: v77.47,6.54 v77.47,7.81 77.47,8.03 C2.1 68.58,9.08 67.94,8.45 v65.41,8.45
LED+5
  Top 0.61: U5.4 R23.1
  Top 1.016: R23.1 R45.1 83.5,79.56 C21.1 87,80.62 LED10W5.1
LED+6  (via drill 0.5)
  Top 0.61: U4.4 R24.1
  Top 1.016: R24.1 R46.1 75.25,78.61 v74.3,79.56 v73.03,79.56 | LED10W6.1 60.33,80.83 v61.59,79.56 v62.23,78.93 C23.1
  Bottom 1.016: v61.59,79.56 v62.23,78.93 71.12,78.93 71.75,79.56 v74.3,79.56
LED+7
  Top 0.61: R14.1 U8.4
  Top 1.016: LED10W7.1 49.53,79.98 C13.1 43.49,78.93 R15.1 R14.1
LED+8  (via drill 0.5)
  Top 0.61: R13.1 U7.4
  Top 1.016: R13.1 R16.1 35.88,78.61 v34.92,79.56 v33.66,79.56 | C10.1 22.86,79.35 v22.86,79.56 v22.86,80.83 LED10W8.1
  Bottom 1.016: v22.86,80.83 v22.86,79.56 v34.92,79.56
LED-1
  Top 1.016: LED10W2.2 36.2,6.54 35.56,7.17 35.56,8.23 C6.2 35.34,14.12 L5.2
LED-2
  Top 1.016: LED10W1.2 9.53,5.27 8.26,6.54 8.26,8.03 C8.2 8.68,13.29 L6.2
LED-3
  Top 1.016: LED10W3.2 46.99,8.03 C4.2 48.05,14.58 49.53,16.06 49.53,15.61 L4.2
LED-4
  Top 1.016: LED10W4.2 73.66,8.03 C2.2 74.72,14.12 L1.2
LED-5
  Top 1.016: LED10W5.2 90.81,80.62 C21.2 89.75,73.96 L3.2
LED-6
  Top 1.016: LED10W6.2 64.14,81.47 65.41,80.2 65.41,79.35 C23.2 64.98,73.43 64.14,72.58 L2.2
LED-7
  Top 1.016: LED10W7.2 53.34,79.98 C13.2 52.28,73.89 L8.2
LED-8
  Top 1.016: LED10W8.2 26.67,79.35 C10.2 25.61,73.89 L7.2
MISO_5V  (via drill 0.5)
  Top 0.305: AT328.16 45.34,34.11 ISP.1 | v46.35,20.51 45.09,21.78 45.09,28.13 v48.26,31.3
  Bottom 0.305: EXT1.MISO 88.77,16.57 87,14.79 52.07,14.79 v46.35,20.51 | ISP.1 46.99,33.84 48.26,32.58 v48.26,31.3
MOSI_5V  (via drill 0.5)
  Top 0.305: AT328.15 44.45,38.98 44.45,37.66 43.18,36.38 42.55,36.38 41.27,35.11 41.27,33.21 42.55,31.94 ISP.4 43.18,30.92 43.18,20.51 44.45,19.24 v49.53,19.24
  Bottom 0.305: EXT1.MOSI 91.44,19.88 90.17,21.14 74.93,21.14 69.22,15.43 53.34,15.43 v49.53,19.24
N$3
  Top 0.61: 66.36,20.58 D1.A 71.69,20.9 | 71.69,20.9 L1.1 | U1.1 70.52,18 71.75,19.24 71.75,20.84 71.69,20.9
N$4  (via drill 0.5)
  Top 0.61: Q4.3 77.94,30.2 75.56,32.58 v60.33,32.58 v59.05,32.58
  Bottom 0.61: FAN1.1 22.23,10.98 24.77,13.53 29.84,13.53 44.45,28.13 51.44,28.13 55.88,32.58 v59.05,32.58 v60.33,32.58
N$5
  Top 0.61: U2.1 60.01,20.2 59.69,20.51 58.17,20.51 D2.A 52.77,20.9 L4.1
N$6
  Top 0.61: D4.A 68.01,67.11 | 68.01,67.11 L2.1 | U4.1 69.82,70.64 68.58,69.41 68.58,67.68 68.01,67.11
N$7
  Top 0.61: U5.1 79.69,69.33 D5.A 86.8,67.11 L3.1
N$8
  Top 0.61: 26.98,20.58 D3.A 32.32,20.9 | 32.32,20.9 L5.1 | U3.1 31.14,17.37 32.38,18.61 32.38,20.84 32.32,20.9
N$9
  Top 0.61: U6.1 20.64,20.2 20.32,20.51 18.8,20.51 D6.A 11.04,20.9 7.62,24.32 7.44,24.32 L6.1
N$10
  Top 0.61: D7.A 28.64,67.11 | 28.64,67.11 28.48,66.95 L7.1 | U7.1 30.45,70.64 29.21,69.41 29.21,67.68 28.64,67.11
N$11
  Top 0.61: U8.1 40.33,68.45 41.91,66.87 42.3,66.87 D8.A 48.02,67.11 52.07,63.05 51.62,63.05 L8.1
N$12  (via drill 0.5)
  Top 0.61: Q1.3 82.72,30.2 81.28,28.77 77.47,28.77 74.93,31.3 v60.33,31.3 v59.05,31.3
  Bottom 0.61: FAN2.1 28.57,7.17 24.77,7.17 23.5,8.45 23.5,10.35 25.4,12.26 30.48,12.26 45.09,26.86 51.44,26.86 55.88,31.3 v59.05,31.3 v60.33,31.3
N$13  (via drill 0.5)
  Top 0.61: Q2.3 87.63,30.04 79.38,21.78 79.38,12.26 v78.74,11.62 v77.47,11.62
  Bottom 0.61: FAN3.1 59.69,6.54 64.77,11.62 v77.47,11.62 v78.74,11.62
N$14  (via drill 0.5)
  Top 0.61: Q3.3 89.7,30.2 80.64,21.14 80.64,10.98 v80.01,10.35 v78.74,10.35
  Bottom 0.61: FAN4.1 66.04,7.17 64.14,7.17 63.5,7.81 63.5,8.45 65.41,10.35 v78.74,10.35 v80.01,10.35
N$15  (via drill 0.5)
  Top 0.813: Q5.3 v91.44,55.44 v91.44,56.7
  Bottom 0.813: FAN5.1 78.11,82.11 83.19,77.03 87,77.03 91.44,72.58 v91.44,56.7 v91.44,55.44
N$16  (via drill 0.5)
  Top 0.813: Q6.3 v87.63,55.44 v87.63,56.7
  Bottom 0.813: FAN6.1 69.22,82.74 71.12,80.83 76.2,80.83 82.55,74.48 85.09,74.48 87.63,71.94 v87.63,56.7 v87.63,55.44
N$17  (via drill 0.5)
  Top 0.813: Q7.3 83.82,55.44 82.55,56.7 66.67,56.7 65.41,57.98 v65.41,58.61 v65.41,59.88
  Bottom 0.813: FAN7.1 40.64,81.47 45.72,76.39 55.24,76.39 65.41,66.23 v65.41,59.88 v65.41,58.61
N$18  (via drill 0.5)
  Top 0.813: Q8.3 64.31,53.99 61.59,56.7 v61.59,57.34 v61.59,58.61
  Bottom 0.813: FAN8.1 31.75,82.74 33.66,80.83 37.47,80.83 44.45,73.85 53.34,73.85 61.59,65.59 v61.59,58.61 v61.59,57.34
N$22
  Top 0.305: SWITCH.1 10.79,38.29 10.79,38.92 12.06,40.2 R9.1 R6.1 8.68,47.18 4.45,47.18 3.2,48.42 S1.2
N$25
  Top 0.305: POT.1 4.45,41.47 1.27,44.64 1.27,52.26 2.54,53.53 5.71,53.53 12.06,47.18 R5.1
N$27
  cutout Top: 27.94,42.1 30.48,42.1 30.48,40.83 27.94,40.83
N$28
  cutout Top: 27.94,39.56 30.48,39.56 30.48,38.29 27.94,38.29
N$30  (via drill 0.5)
  Top 0.305: R26.1 v65.41,33.84
  Bottom 0.305: v65.41,33.84 72.39,33.84 74.93,36.38 SJ6.3 78.49,34.73 79.38,33.84 81.92,33.84 83.82,35.75 83.82,41.47 | 83.82,41.47 83.82,49.09 | 83.82,49.09 83.82,56.7 83.19,57.34 79.38,57.34 78.74,56.7 78.74,55.69 SJ1.3 | SJ5.3 78.49,41.21 79.38,42.1 | 79.38,42.1 83.19,42.1 83.82,41.47 | SJ4.3 78.49,42.99 79.38,42.1 | SJ3.3 78.49,48.83 79.38,49.72 | 79.38,49.72 83.19,49.72 83.82,49.09 | SJ2.3 78.49,50.61 79.38,49.72
N$35
  Top 0.305: L9.C 27.71,48.22 28.57,49.09 28.57,50.14 R32.1
N$43
  Top 0.305: 30.23,41.4 38.23,41.4 AT328.7
N$44
  Top 0.305: 30.23,38.99 30.55,38.99 31.43,39.88 31.75,40.2 32.12,40.57 AT328.8
OE  (via drill 0.5)
  Top 0.305: U9.23 73.36,44.97 76.2,47.81 76.2,50.99 74.93,52.26 64.14,52.26 58.42,46.55 v57.78,46.55 R27.1 | AT328.2 40.55,45.37 41.27,44.64 43.81,44.64 46.99,47.81 v47.62,47.81
  Bottom 0.305: v47.62,47.81 56.52,47.81 v57.78,46.55
PROTECT_GATE
  Top 0.406: Q9.4 9.09,74.48 R31.1 12.7,74.27 12.7,73.22 14.61,71.94 D9.A
PUSH1  (via drill 0.5)
  Top 0.305: C15.1 R9.2 21.59,40.2 v24.13,42.73 | AT328.32 34.44,47.66 v34.29,47.81
  Bottom 0.305: v24.13,42.73 29.21,42.73 v34.29,47.81
PWM_FAN1
  Top 0.305: U9.15 73.43,39.79 77.47,35.75 80.01,35.75 80.64,35.11 80.64,34.7 R28.2 80.86,32.41 Q4.1
PWM_FAN2
  Top 0.305: U9.16 74.07,40.42 78.11,36.38 80.64,36.38 81.28,35.75 83.4,35.75 R12.2 84.67,32.41 Q1.1
PWM_FAN3
  Top 0.305: U9.17 74.68,41.08 78.74,37.02 81.28,37.02 81.92,36.38 86.58,36.38 R17.2 88.48,32.41 Q2.1
PWM_FAN4
  Top 0.305: U9.18 75.31,41.72 79.38,37.66 81.92,37.66 82.55,37.02 89.75,37.02 R18.2 92.29,32.41 Q3.1
PWM_FAN5
  Top 0.305: U9.19 75.84,42.38 80.64,47.18 88.05,47.18 R19.2 90.59,51.8 Q5.1
PWM_FAN6
  Top 0.305: U9.20 75.23,43.04 80.01,47.81 84.88,47.81 R20.2 86.78,51.8 Q6.1
PWM_FAN7
  Top 0.305: U9.21 74.6,43.67 79.38,48.45 81.7,48.45 R22.2 82.97,51.8 Q7.1
PWM_FAN8
  Top 0.305: U9.22 73.78,44.34 R25.2 79.16,51.8 Q8.1
PWM_LED_1  (via drill 0.5)
  Top 0.305: U9.6 63.8,44.97 62.87,45.91 61.59,45.91 60.33,44.64 60.33,44.01 56.52,40.2 v54.61,38.92 | U6.3 17.18,17.37 v17.14,17.34
  Bottom 0.305: v17.14,17.34 20.32,17.34 29.84,26.86 29.84,32.58 36.2,38.92 v54.61,38.92
PWM_LED_2  (via drill 0.5)
  Top 0.305: U9.7 63.17,44.34 62.87,44.64 61.59,44.64 60.96,44.01 60.96,43.37 v56.52,38.92 | U3.3 23.52,17.37 v23.5,17.34
  Bottom 0.305: v23.5,17.34 24.13,17.97 24.13,19.88 30.48,26.23 30.48,31.94 36.83,38.29 52.7,38.29 53.34,37.66 55.88,37.66 56.52,38.29 v56.52,38.92
PWM_LED_3  (via drill 0.5)
  Top 0.305: U9.8 63.8,43.67 v63.5,43.37 | U2.3 56.55,18 v56.52,17.97
  Bottom 0.305: v63.5,43.37 63.5,31.3 55.24,23.05 55.24,19.24 v56.52,17.97
PWM_LED_4  (via drill 0.5)
  Top 0.305: U9.9 66.37,43.04 66.67,42.73 66.67,38.92 v66.04,38.29 | U1.3 62.9,18 v62.87,17.97
  Bottom 0.305: v66.04,38.29 64.14,36.38 64.14,30.67 59.69,26.23 59.69,21.14 v62.87,17.97
PWM_LED_5  (via drill 0.5)
  Top 0.305: U5.3 83.16,70.64 v83.19,70.67 | U9.10 62.59,42.38 v61.85,43.37
  Bottom 0.305: v83.19,70.67 80.01,70.67 73.03,63.69 73.03,59.24 61.59,47.81 61.59,43.62 v61.85,43.37
PWM_LED_6  (via drill 0.5)
  Top 0.305: U4.3 75.25,70.99 v76.2,71.94 | U9.11 61.34,41.72 v60.96,42.1
  Bottom 0.305: v76.2,71.94 76.2,68.14 72.39,64.33 72.39,59.88 60.33,47.81 60.33,42.73 v60.96,42.1
PWM_LED_7  (via drill 0.5)
  Top 0.305: U9.12 61.21,41.08 v60.96,40.83 | U8.3 45.69,70.64 v45.72,70.67
  Bottom 0.305: v60.96,40.83 60.33,40.83 59.69,41.47 59.69,49.72 48.26,61.15 48.26,68.14 v45.72,70.67
PWM_LED_8  (via drill 0.5)
  Top 0.305: U9.13 62.46,40.42 v61.59,39.56 | U7.3 37.44,70.64 v37.47,70.67
  Bottom 0.305: v61.59,39.56 60.33,39.56 59.05,40.83 59.05,49.09 v37.47,70.67
RAW_FUSED
  pour Top (rank 2): 11.43,62.42 11.43,63.69 12.06,64.33 16.51,64.33 18.41,66.23 18.41,73.22 16.51,75.12 16.51,80.2 18.41,82.11 18.41,85.92 21.59,89.09 98.42,89.09 98.42,-1.08 15.88,-1.08 15.88,7.17 19.05,10.35 19.05,14.79 20.95,16.7 20.95,19.88 19.68,21.14 19.05,21.14 18.41,21.78 17.78,21.78 17.78,29.4 17.14,30.04 13.97,30.04 13.34,30.67 13.34,33.21 13.97,33.84 24.13,33.84 27.94,30.04 27.94,21.78 27.3,21.14 26.67,21.14 24.13,18.61 24.13,16.7 25.4,15.43 29.21,15.43 29.84,14.79 29.84,10.35 31.75,8.45 56.52,8.45 58.42,10.35 58.42,15.43 60.33,17.34 60.33,19.88 59.05,21.14 57.78,21.14 57.15,21.78 57.15,28.77 58.42,30.04 66.04,30.04 67.31,28.77 67.31,21.78 66.67,21.14 66.04,21.14 65.41,20.51 64.77,20.51 63.5,19.24 63.5,17.34 64.77,16.06 68.58,16.06 69.22,15.43 69.22,10.98 71.12,9.08 83.19,9.08 83.82,8.45 87.63,8.45 90.17,10.98 90.17,26.86 92.08,28.77 92.08,35.11 90.17,37.02 90.17,46.55 93.34,49.72 93.34,53.53 85.72,61.15 83.19,61.15 80.64,58.61 73.66,58.61 72.39,59.88 72.39,66.23 73.66,67.5 74.93,67.5 76.2,68.77 76.2,70.67 74.93,72.58 71.75,72.58 70.48,73.22 70.48,76.39 67.94,78.93 43.18,78.93 41.91,77.66 41.91,73.22 40.01,71.31 40.01,68.77 42.55,66.23 43.18,66.23 43.18,59.88 41.91,58.61 34.29,58.61 33.02,59.88 33.02,66.23 34.92,68.14 35.56,68.14 36.83,69.41 36.83,71.31 35.56,72.58 32.38,72.58 29.84,70.67 28.57,67.5 24.77,63.05 22.86,63.05 21.59,61.78 12.06,61.78
RAW_POL_PROTECTED1
  Top 0.406: Q9.1 11.19,69.41 TVS.C 11.19,71.37 D9.C
  pour Top: 5.08,80.2 9.53,80.2 9.53,68.14 5.08,68.14
RAW_UNPROTECTED1
  pour Top: -0.64,89.09 11.43,89.09 11.43,80.83 4.45,80.83 4.45,68.14 -0.64,68.14
RESET_5V  (via drill 0.5)
  Top 0.305: R21.1 C26.2 13.34,52.48 13.34,56.07 16.51,59.24 20.32,59.24 23.5,56.07 39.37,56.07 42.15,53.3 AT328.29 42.15,46.31 v42.55,45.91
  Bottom 0.305: v42.55,45.91 48.9,45.91 54.61,40.2 57.78,40.2 59.69,38.29 59.69,37.02 58.42,35.75 47.62,35.75 46.99,36.38 41.91,36.38 40.01,34.48 ISP.5
RX-I
  Top 0.305: AT328.30 41.34,52.83 38.73,55.44 21.59,55.44 20.95,56.07 17.78,56.07 17.14,55.44 17.14,53.53 17.78,52.9 18.54,52.9 PROG1.3
SCK_5V  (via drill 0.5)
  Top 0.305: 43.81,32.58 45.72,32.58 46.99,33.84 46.99,40.42 AT328.17 | ISP.3 42.55,33.84 43.81,32.58 | 43.81,32.58 43.81,21.14 v44.45,20.51
  Bottom 0.305: EXT1.SCK 91.44,16.7 88.9,14.16 50.8,14.16 v44.45,20.51
SCL
  Top 0.305: U9.26 73.41,46.93 74.3,47.81 74.3,49.72 72.39,51.62 64.77,51.62 59.05,45.91 59.05,45.27 56.77,42.99 55.41,42.99 R29.1 53.34,44.01 50.8,46.55 50.8,47.81 48.26,50.35 43.81,50.35 42.95,49.48 AT328.28
SDA
  Top 0.305: U9.27 72.8,47.59 73.66,48.45 73.66,49.09 71.75,50.99 65.41,50.99 59.69,45.27 59.69,44.64 57.4,42.35 55.28,42.35 R30.1 53.34,41.47 50.16,44.64 50.16,47.18 47.62,49.72 44.45,49.72 43.81,49.09 43.81,47.73 AT328.27
TX-O
  Top 0.305: AT328.31 40.55,52.35 38.1,54.8 PROG1.2

### Text on the board
tPlace: o
Document: BRD+4mm diam4mm